# EAGLE schematic rpi_cm3plus_tablet (EAGLE 7.7.0)
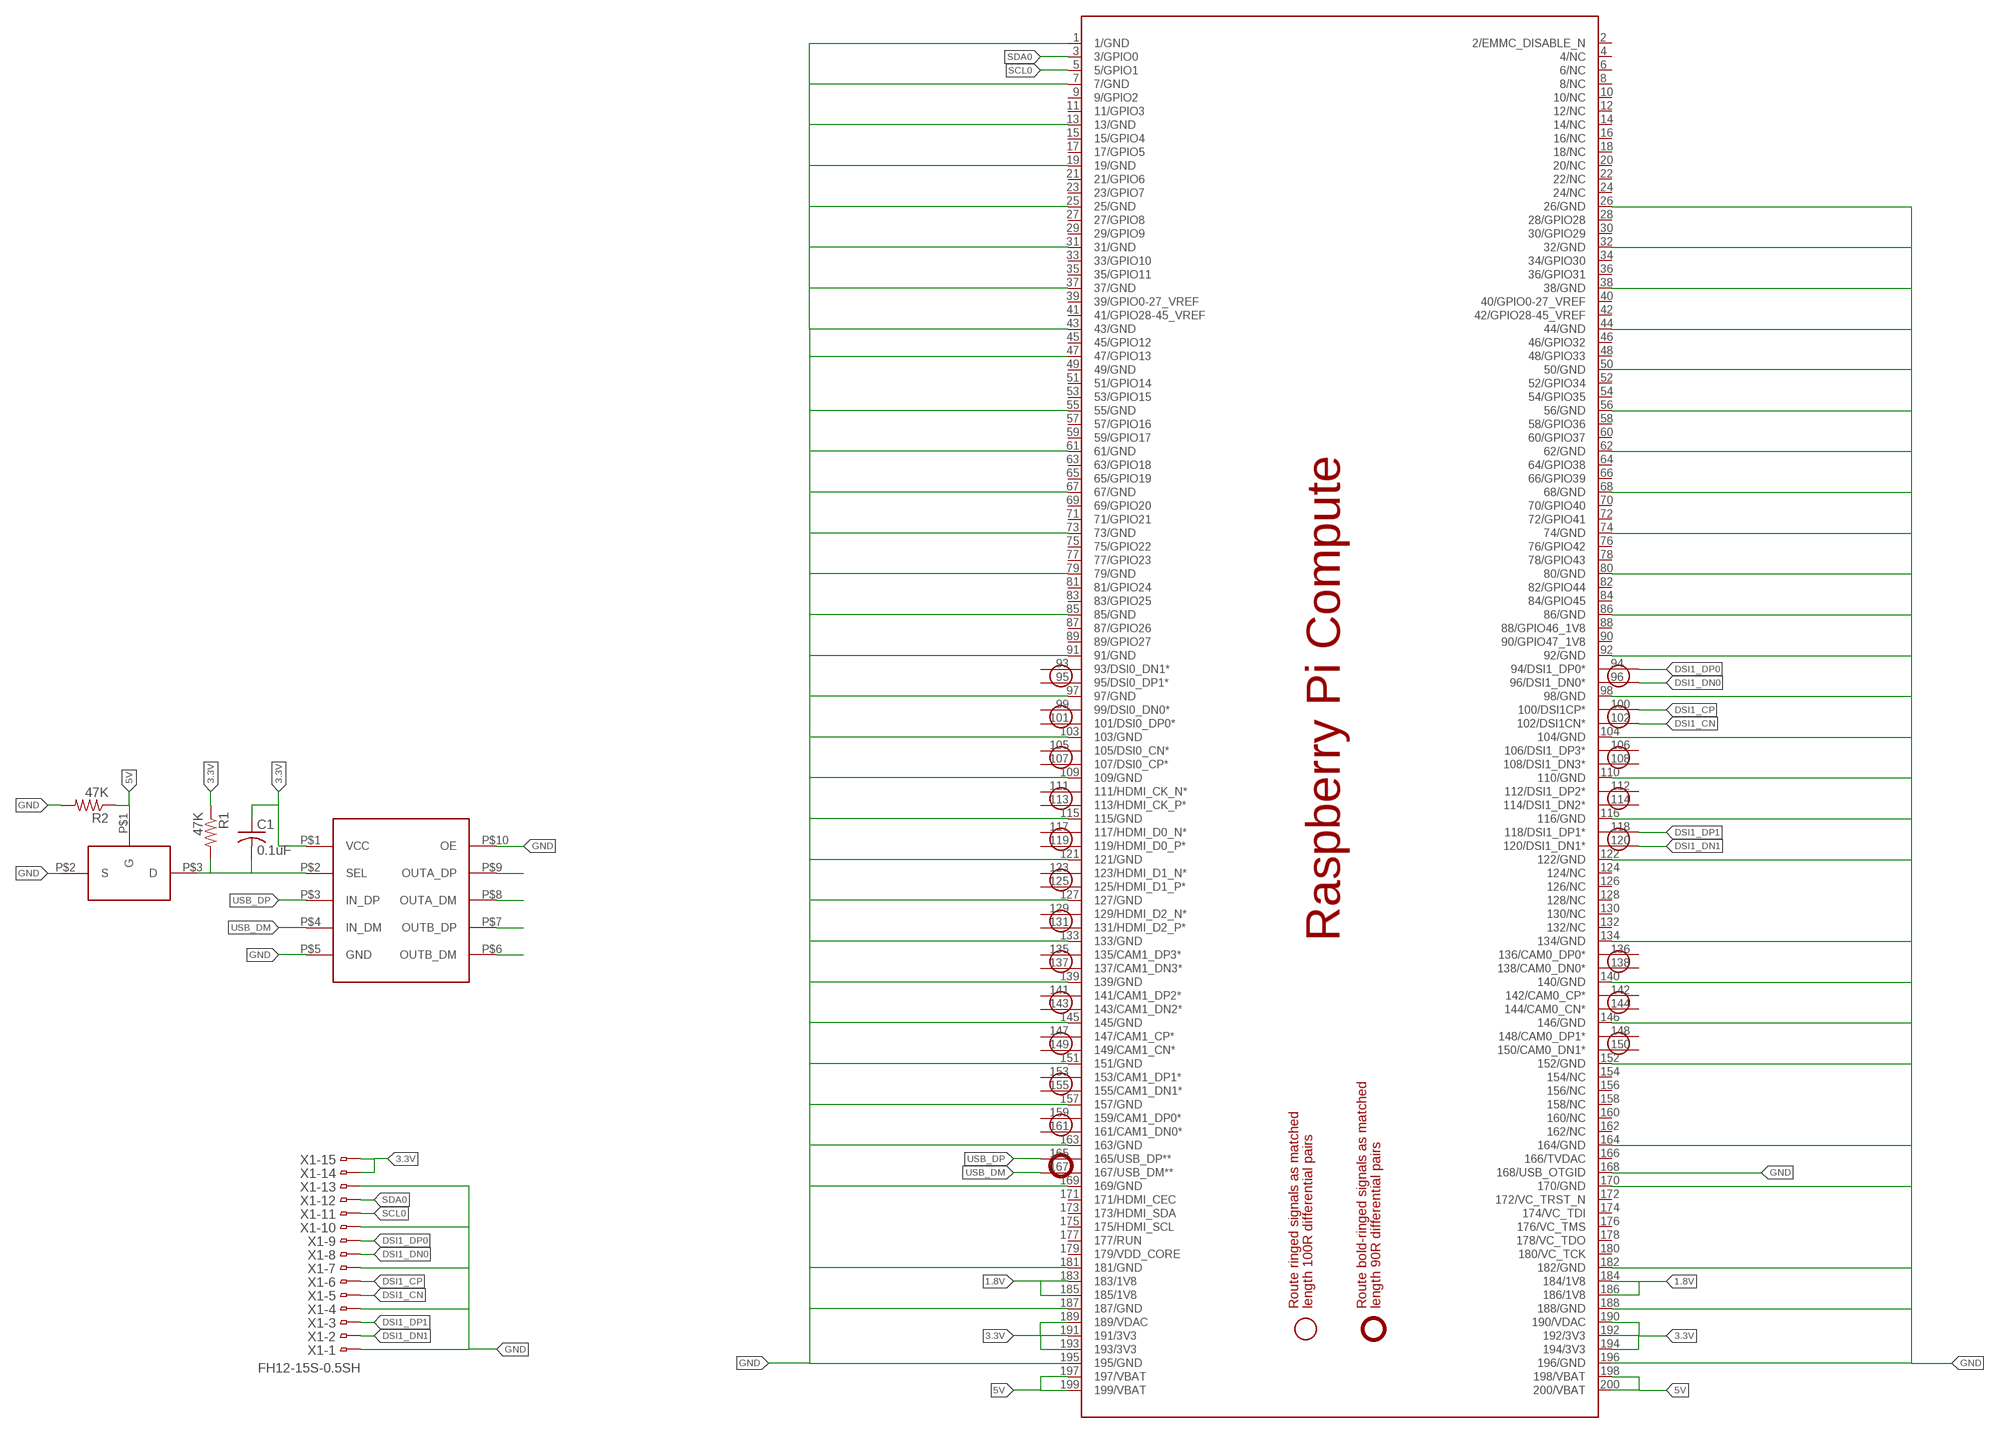
[diagram p0: schematic, sheet 1]

## Parts
C1  0.1uF  C-USC0603K  [C0603K]
PCB1  RPI_COMPUTE  [RPI_COMPUTE]
R1  47K  R-US_R0603  [R0603]
R2  47K  R-US_R0603  [R0603]
U$1  FSUSB42MUX  [MSOP-10]
U$2  BSS138N  [SOT-23]
X1  FH12-15S-0.5SH  [FH12-15S-0.5SH]

## Nets
1.8V: PCB1.183(183/1V8) PCB1.184(184/1V8) PCB1.185(185/1V8) PCB1.186(186/1V8)
3.3V: C1.1 PCB1.189(189/VDAC) PCB1.190(190/VDAC) PCB1.191(191/3V3) PCB1.192(192/3V3) PCB1.193(193/3V3) PCB1.194(194/3V3) R1.1 U$1.P$1(VCC) X1.14 X1.15
5V: PCB1.197(197/VBAT) PCB1.198(198/VBAT) PCB1.199(199/VBAT) PCB1.200(200/VBAT) R2.1 U$2.P$1(G)
DSI1_CN: PCB1.102(102/DSI1CN*) X1.5
DSI1_CP: PCB1.100(100/DSI1CP*) X1.6
DSI1_DN0: PCB1.96(96/DSI1_DN0*) X1.8
DSI1_DN1: PCB1.120(120/DSI1_DN1*) X1.2
DSI1_DP0: PCB1.94(94/DSI1_DP0*) X1.9
DSI1_DP1: PCB1.118(118/DSI1_DP1*) X1.3
GND: PCB1.1(1/GND) PCB1.7(7/GND) PCB1.13(13/GND) PCB1.19(19/GND) PCB1.25(25/GND) PCB1.26(26/GND) PCB1.31(31/GND) PCB1.32(32/GND) PCB1.37(37/GND) PCB1.38(38/GND) PCB1.43(43/GND) PCB1.44(44/GND) PCB1.47(47/GPIO13) PCB1.50(50/GND) PCB1.55(55/GND) PCB1.56(56/GND) PCB1.61(61/GND) PCB1.62(62/GND) PCB1.67(67/GND) PCB1.68(68/GND) PCB1.73(73/GND) PCB1.74(74/GND) PCB1.79(79/GND) PCB1.80(80/GND) PCB1.85(85/GND) PCB1.86(86/GND) PCB1.91(91/GND) PCB1.92(92/GND) PCB1.97(97/GND) PCB1.98(98/GND) PCB1.103(103/GND) PCB1.104(104/GND) PCB1.109(109/GND) PCB1.110(110/GND) PCB1.115(115/GND) PCB1.116(116/GND) PCB1.121(121/GND) PCB1.122(122/GND) PCB1.127(127/GND) PCB1.133(133/GND) PCB1.134(134/GND) PCB1.139(139/GND) PCB1.140(140/GND) PCB1.145(145/GND) PCB1.146(146/GND) PCB1.151(151/GND) PCB1.152(152/GND) PCB1.157(157/GND) PCB1.163(163/GND) PCB1.164(164/GND) PCB1.168(168/USB_OTGID) PCB1.169(169/GND) PCB1.170(170/GND) PCB1.181(181/GND) PCB1.182(182/GND) PCB1.187(187/GND) PCB1.188(188/GND) PCB1.195(195/GND) PCB1.196(196/GND) R2.2 U$1.P$5(GND) U$1.P$10(OE) U$2.P$2(S) X1.1 X1.4 X1.7 X1.10 X1.13
N$3: C1.2 R1.2 U$1.P$2(SEL) U$2.P$3(D)
N$4: U$1.P$9(OUTA_DP)
N$5: U$1.P$8(OUTA_DM)
N$6: U$1.P$7(OUTB_DP)
N$7: U$1.P$6(OUTB_DM)
SCL0: PCB1.5(5/GPIO1) X1.11
SDA0: PCB1.3(3/GPIO0) X1.12
USB_DM: PCB1.167(167/USB_DM**) U$1.P$4(IN_DM)
USB_DP: PCB1.165(165/USB_DP**) U$1.P$3(IN_DP)
Unconnected: PCB1.2(2/EMMC_DISABLE_N) PCB1.4(4/NC) PCB1.6(6/NC) PCB1.8(8/NC) PCB1.9(9/GPIO2) PCB1.10(10/NC) PCB1.11(11/GPIO3) PCB1.12(12/NC) PCB1.14(14/NC) PCB1.15(15/GPIO4) PCB1.16(16/NC) PCB1.17(17/GPIO5) PCB1.18(18/NC) PCB1.20(20/NC) PCB1.21(21/GPIO6) PCB1.22(22/NC) PCB1.23(23/GPIO7) PCB1.24(24/NC) PCB1.27(27/GPIO8) PCB1.28(28/GPIO28) PCB1.29(29/GPIO9) PCB1.30(30/GPIO29) PCB1.33(33/GPIO10) PCB1.34(34/GPIO30) PCB1.35(35/GPIO11) PCB1.36(36/GPIO31) PCB1.39(39/GPIO0-27_VREF) PCB1.40(40/GPIO0-27_VREF) PCB1.41(41/GPIO28-45_VREF) PCB1.42(42/GPIO28-45_VREF) PCB1.45(45/GPIO12) PCB1.46(46/GPIO32) PCB1.48(48/GPIO33) PCB1.49(49/GND) PCB1.51(51/GPIO14) PCB1.52(52/GPIO34) PCB1.53(53/GPIO15) PCB1.54(54/GPIO35) PCB1.57(57/GPIO16) PCB1.58(58/GPIO36) PCB1.59(59/GPIO17) PCB1.60(60/GPIO37) PCB1.63(63/GPIO18) PCB1.64(64/GPIO38) PCB1.65(65/GPIO19) PCB1.66(66/GPIO39) PCB1.69(69/GPIO20) PCB1.70(70/GPIO40) PCB1.71(71/GPIO21) PCB1.72(72/GPIO41) PCB1.75(75/GPIO22) PCB1.76(76/GPIO42) PCB1.77(77/GPIO23) PCB1.78(78/GPIO43) PCB1.81(81/GPIO24) PCB1.82(82/GPIO44) PCB1.83(83/GPIO25) PCB1.84(84/GPIO45) PCB1.87(87/GPIO26) PCB1.88(88/GPIO46_1V8) PCB1.89(89/GPIO27) PCB1.90(90/GPIO47_1V8) PCB1.93(93/DSI0_DN1*) PCB1.95(95/DSI0_DP1*) PCB1.99(99/DSI0_DN0*) PCB1.101(101/DSI0_DP0*) PCB1.105(105/DSI0_CN*) PCB1.106(106/DSI1_DP3*) PCB1.107(107/DSI0_CP*) PCB1.108(108/DSI1_DN3*) PCB1.111(111/HDMI_CK_N*) PCB1.112(112/DSI1_DP2*) PCB1.113(113/HDMI_CK_P*) PCB1.114(114/DSI1_DN2*) PCB1.117(117/HDMI_D0_N*) PCB1.119(119/HDMI_D0_P*) PCB1.123(123/HDMI_D1_N*) PCB1.124(124/NC) PCB1.125(125/HDMI_D1_P*) PCB1.126(126/NC) PCB1.128(128/NC) PCB1.129(129/HDMI_D2_N*) PCB1.130(130/NC) PCB1.131(131/HDMI_D2_P*) PCB1.132(132/NC) PCB1.135(135/CAM1_DP3*) PCB1.136(136/CAM0_DP0*) PCB1.137(137/CAM1_DN3*) PCB1.138(138/CAM0_DN0*) PCB1.141(141/CAM1_DP2*) PCB1.142(142/CAM0_CP*) PCB1.143(143/CAM1_DN2*) PCB1.144(144/CAM0_CN*) PCB1.147(147/CAM1_CP*) PCB1.148(148/CAM0_DP1*) PCB1.149(149/CAM1_CN*) PCB1.150(150/CAM0_DN1*) PCB1.153(153/CAM1_DP1*) PCB1.154(154/NC) PCB1.155(155/CAM1_DN1*) PCB1.156(156/NC) PCB1.158(158/NC) PCB1.159(159/CAM1_DP0*) PCB1.160(160/NC) PCB1.161(161/CAM1_DN0*) PCB1.162(162/NC) PCB1.166(166/TVDAC) PCB1.171(171/HDMI_CEC) PCB1.172(172/VC_TRST_N) PCB1.173(173/HDMI_SDA) PCB1.174(174/VC_TDI) PCB1.175(175/HDMI_SCL) PCB1.176(176/VC_TMS) PCB1.177(177/RUN) PCB1.178(178/VC_TDO) PCB1.179(179/VDD_CORE) PCB1.180(180/VC_TCK)

## Library data of the parts
C1 = resistor:C-US: CAPACITOR, American symbol
PCB1 = rpi_cm3plus_tablet:RPI_COMPUTE: Device for a Raspberry PI Compute module. Note that the package is for a DDR2 connector of 'standard' orientation. Example: TE Connectivity P/N: 1565917-4, Newark P/N: 08P0616, Farnell P/N: 2112525 More information is available at http://www.element14.com/community/community/raspberry-pi/raspberry-pi-compute-module
R1 R2 = resistor:R-US_: RESISTOR, American symbol
U$1 = rpi_cm3plus_tablet:FSUSB42MUX: https://www.mouser.com/ProductDetail/ON-Semiconductor-Fairchild/FSUSB42MUX?qs=sGAEpiMZZMuCmTIBzycWfLqUvx%252BoipQGxMYBKnuhRxA%3D
U$2 = rpi_cm3plus_tablet:BSS138N
X1 = con-hirose:FH12-15S-0.5S: 0.5mm Pitch Connectors For FPC/FFC Source: Data sheet <http://www.hirose.co.jp/cataloge_hp/e58605370.pdf>; OC_FARNELL: 1324545; OC_NEWARK: unknown